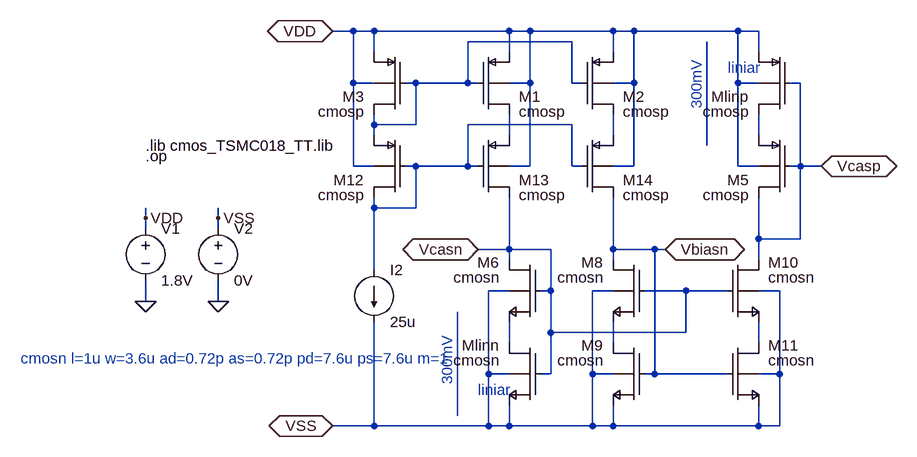
[diagram p0: schematic test_bias.asc]
test_bias.asc, the LTspice schematic file:
Version 4
SHEET 1 2040 716
WIRE 992 -16 960 -16
WIRE 1024 -16 992 -16
WIRE 1232 -16 1024 -16
WIRE 1264 -16 1232 -16
WIRE 1392 -16 1264 -16
WIRE 1424 -16 1392 -16
WIRE 1584 -16 1424 -16
WIRE 1616 -16 1584 -16
WIRE 1328 0 1168 0
WIRE 1024 16 1024 -16
WIRE 1232 16 1232 -16
WIRE 1392 16 1392 -16
WIRE 1616 16 1616 -16
WIRE 992 64 992 -16
WIRE 1024 64 992 64
WIRE 1088 64 1072 64
WIRE 1168 64 1168 0
WIRE 1168 64 1088 64
WIRE 1184 64 1168 64
WIRE 1264 64 1264 -16
WIRE 1264 64 1232 64
WIRE 1328 64 1328 0
WIRE 1344 64 1328 64
WIRE 1424 64 1424 -16
WIRE 1424 64 1392 64
WIRE 1584 64 1584 -16
WIRE 1616 64 1584 64
WIRE 1680 64 1664 64
WIRE 1024 128 1024 112
WIRE 1088 128 1088 64
WIRE 1088 128 1024 128
WIRE 1328 128 1168 128
WIRE 1024 144 1024 128
WIRE 1232 144 1232 112
WIRE 1392 144 1392 112
WIRE 1616 144 1616 112
WIRE 1536 160 1536 0
WIRE 992 192 992 64
WIRE 1024 192 992 192
WIRE 1088 192 1072 192
WIRE 1168 192 1168 128
WIRE 1168 192 1088 192
WIRE 1184 192 1168 192
WIRE 1264 192 1264 64
WIRE 1264 192 1232 192
WIRE 1328 192 1328 128
WIRE 1344 192 1328 192
WIRE 1424 192 1424 64
WIRE 1424 192 1392 192
WIRE 1584 192 1584 64
WIRE 1616 192 1584 192
WIRE 1680 192 1680 64
WIRE 1680 192 1664 192
WIRE 1712 192 1680 192
WIRE 1024 256 1024 240
WIRE 1088 256 1088 192
WIRE 1088 256 1024 256
WIRE 672 272 672 256
WIRE 784 272 784 256
WIRE 672 288 672 272
WIRE 784 288 784 272
WIRE 1616 304 1616 240
WIRE 1680 304 1680 192
WIRE 1680 304 1616 304
WIRE 1232 320 1232 240
WIRE 1232 320 1184 320
WIRE 1296 320 1232 320
WIRE 1392 320 1392 240
WIRE 1456 320 1392 320
WIRE 1472 320 1456 320
WIRE 1232 336 1232 320
WIRE 1392 336 1392 320
WIRE 1616 336 1616 304
WIRE 1024 352 1024 256
WIRE 1232 384 1200 384
WIRE 1296 384 1296 320
WIRE 1296 384 1280 384
WIRE 1392 384 1360 384
WIRE 1504 384 1440 384
WIRE 1568 384 1504 384
WIRE 1648 384 1616 384
WIRE 672 400 672 368
WIRE 784 400 784 368
WIRE 1296 448 1296 384
WIRE 1504 448 1504 384
WIRE 1504 448 1296 448
WIRE 1232 464 1232 432
WIRE 1392 464 1392 432
WIRE 1616 464 1616 432
WIRE 1200 512 1200 384
WIRE 1232 512 1200 512
WIRE 1296 512 1296 448
WIRE 1296 512 1280 512
WIRE 1360 512 1360 384
WIRE 1392 512 1360 512
WIRE 1456 512 1456 320
WIRE 1456 512 1440 512
WIRE 1568 512 1456 512
WIRE 1648 512 1648 384
WIRE 1648 512 1616 512
WIRE 1152 576 1152 416
WIRE 1024 592 1024 432
WIRE 1024 592 960 592
WIRE 1200 592 1200 512
WIRE 1200 592 1024 592
WIRE 1232 592 1232 560
WIRE 1232 592 1200 592
WIRE 1360 592 1360 512
WIRE 1360 592 1232 592
WIRE 1392 592 1392 560
WIRE 1392 592 1360 592
WIRE 1616 592 1616 560
WIRE 1616 592 1392 592
WIRE 1648 592 1648 512
WIRE 1648 592 1616 592
FLAG 784 400 0
FLAG 672 400 0
FLAG 672 272 VDD
FLAG 784 272 VSS
FLAG 1472 320 Vbiasn
IOPIN 1472 320 BiDir
FLAG 1712 192 Vcasp
IOPIN 1712 192 BiDir
FLAG 1184 320 Vcasn
IOPIN 1184 320 BiDir
FLAG 960 -16 VDD
IOPIN 960 -16 BiDir
FLAG 960 592 VSS
IOPIN 960 592 BiDir
SYMBOL voltage 672 272 R0
SYMATTR InstName V1
SYMATTR Value 1.8V
SYMBOL voltage 784 272 R0
SYMATTR InstName V2
SYMATTR Value 0V
SYMBOL current 1024 352 R0
SYMATTR InstName I2
SYMATTR Value 25u
SYMBOL pmosb 1184 16 R0
SYMATTR InstName M1
SYMATTR Value cmosp
SYMATTR Value2 l=1u w=14u ad=2.8p as=2.8p pd=28.4u ps=28.4u m=1
SYMBOL pmosb 1344 16 R0
SYMATTR InstName M2
SYMATTR Value cmosp
SYMATTR Value2 l=1u w=14u ad=2.8p as=2.8p pd=28.4u ps=28.4u m=1
SYMBOL pmosb 1072 16 M0
SYMATTR InstName M3
SYMATTR Value cmosp
SYMATTR Value2 l=1u w=14u ad=2.8p as=2.8p pd=28.4u ps=28.4u m=1
SYMBOL pmosb 1664 16 M0
SYMATTR InstName Mlinp
SYMATTR Value cmosp
SYMATTR Value2 l=2u w=6.3u ad=1.26p as=1.26p pd=13u ps=13u m=1
SYMBOL pmosb 1664 144 M0
SYMATTR InstName M5
SYMATTR Value cmosp
SYMATTR Value2 l=1u w=14u ad=2.8p as=2.8p pd=28.4u ps=28.4u m=1
SYMBOL nmosb 1280 336 M0
SYMATTR InstName M6
SYMATTR Value cmosn
SYMATTR Value2 l=1u w=2.7u ad=0.54p as=0.54p pd=5.8u ps=5.8u m=1
SYMBOL nmosb 1280 464 M0
SYMATTR InstName Mlinn
SYMATTR Value cmosn
SYMATTR Value2 l=2u w=1.3u ad=0.26p as=0.26p pd=3u ps=3u m=1
SYMBOL nmosb 1440 336 M0
SYMATTR InstName M8
SYMATTR Value cmosn
SYMATTR Value2 l=1u w=2.7u ad=0.54p as=0.54p pd=5.8u ps=5.8u m=1
SYMBOL nmosb 1440 464 M0
SYMATTR InstName M9
SYMATTR Value cmosn
SYMATTR Value2 l=1u w=2.7u ad=0.54p as=0.54p pd=5.8u ps=5.8u m=1
SYMBOL nmosb 1568 336 R0
SYMATTR InstName M10
SYMATTR Value cmosn
SYMATTR Value2 l=1u w=2.7u ad=0.54p as=0.54p pd=5.8u ps=5.8u m=1
SYMBOL nmosb 1568 464 R0
SYMATTR InstName M11
SYMATTR Value cmosn
SYMATTR Value2 l=1u w=2.7u ad=0.54p as=0.54p pd=5.8u ps=5.8u m=1
SYMBOL pmosb 1072 144 M0
SYMATTR InstName M12
SYMATTR Value cmosp
SYMATTR Value2 l=1u w=14u ad=2.8p as=2.8p pd=28.4u ps=28.4u m=1
SYMBOL pmosb 1184 144 R0
SYMATTR InstName M13
SYMATTR Value cmosp
SYMATTR Value2 l=1u w=14u ad=2.8p as=2.8p pd=28.4u ps=28.4u m=1
SYMBOL pmosb 1344 144 R0
SYMATTR InstName M14
SYMATTR Value cmosp
SYMATTR Value2 l=1u w=14u ad=2.8p as=2.8p pd=28.4u ps=28.4u m=1
TEXT 672 160 Left 2 !.lib cmos_TSMC018_TT.lib
TEXT 672 176 Left 2 !.op
TEXT 1184 536 Left 2 ;liniar
TEXT 1568 40 Left 2 ;liniar
TEXT 1136 528 VLeft 2 ;300mV
TEXT 480 488 Left 2 ;cmosn l=1u w=3.6u ad=0.72p as=0.72p pd=7.6u ps=7.6u m=1
TEXT 1520 104 VLeft 2 ;300mV

The netlist it stands for:
* test_bias.asc
V1 VDD 0 1.8V
V2 VSS 0 0V
I2 N002 VSS 25u
M1 N003 N001 VDD VDD cmosp l=1u w=14u ad=2.8p as=2.8p pd=28.4u ps=28.4u m=1
M2 N004 N001 VDD VDD cmosp l=1u w=14u ad=2.8p as=2.8p pd=28.4u ps=28.4u m=1
M3 N001 N001 VDD VDD cmosp l=1u w=14u ad=2.8p as=2.8p pd=28.4u ps=28.4u m=1
Mlinp N005 Vcasp VDD VDD cmosp l=2u w=6.3u ad=1.26p as=1.26p pd=13u ps=13u m=1
M5 Vcasp Vcasp N005 VDD cmosp l=1u w=14u ad=2.8p as=2.8p pd=28.4u ps=28.4u m=1
M6 Vcasn Vcasn N007 VSS cmosn l=1u w=2.7u ad=0.54p as=0.54p pd=5.8u ps=5.8u m=1
Mlinn N007 Vcasn VSS VSS cmosn l=2u w=1.3u ad=0.26p as=0.26p pd=3u ps=3u m=1
M8 Vbiasn Vcasn N008 VSS cmosn l=1u w=2.7u ad=0.54p as=0.54p pd=5.8u ps=5.8u m=1
M9 N008 Vbiasn VSS VSS cmosn l=1u w=2.7u ad=0.54p as=0.54p pd=5.8u ps=5.8u m=1
M10 Vcasp Vcasn N009 VSS cmosn l=1u w=2.7u ad=0.54p as=0.54p pd=5.8u ps=5.8u m=1
M11 N009 Vbiasn VSS VSS cmosn l=1u w=2.7u ad=0.54p as=0.54p pd=5.8u ps=5.8u m=1
M12 N002 N002 N001 VDD cmosp l=1u w=14u ad=2.8p as=2.8p pd=28.4u ps=28.4u m=1
M13 Vcasn N002 N003 VDD cmosp l=1u w=14u ad=2.8p as=2.8p pd=28.4u ps=28.4u m=1
M14 Vbiasn N002 N004 VDD cmosp l=1u w=14u ad=2.8p as=2.8p pd=28.4u ps=28.4u m=1
.model NMOS NMOS
.model PMOS PMOS
.lib standard.mos
.lib cmos_TSMC018_TT.lib
.op
* liniar
* liniar
* 300mV
* cmosn l=1u w=3.6u ad=0.72p as=0.72p pd=7.6u ps=7.6u m=1
* 300mV
.backanno
.end